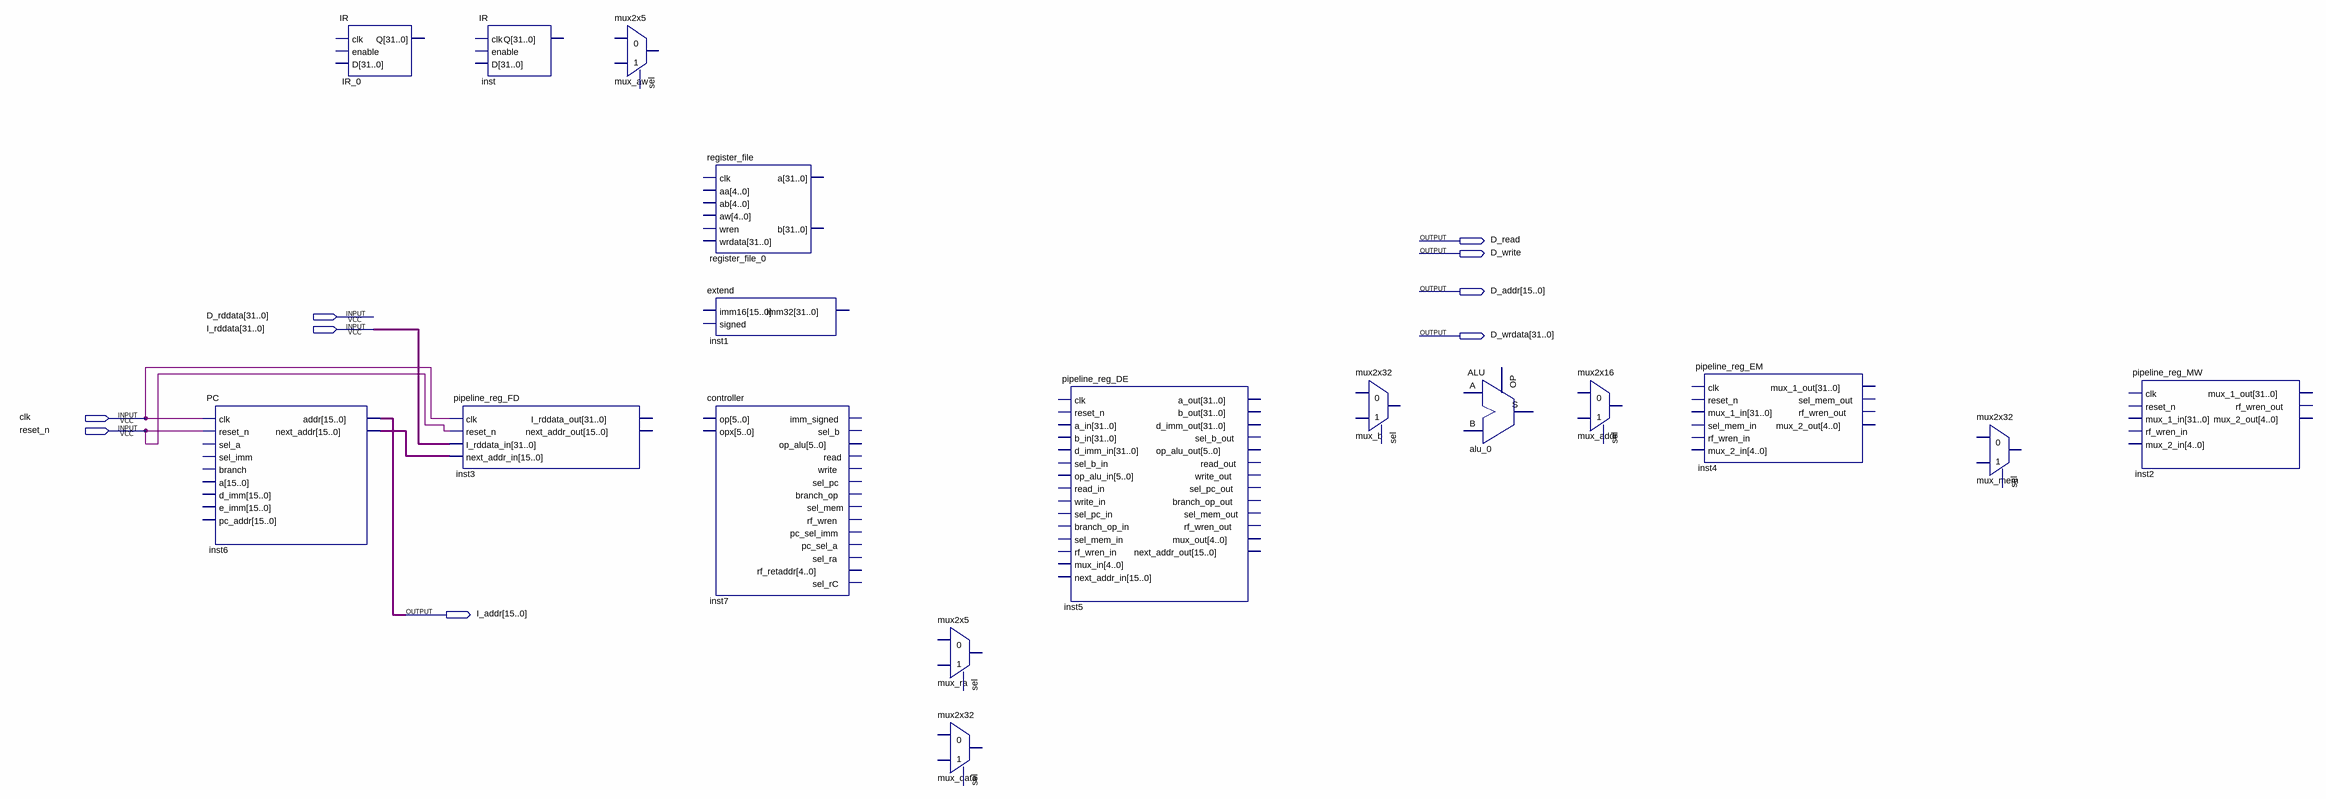
[diagram p0: schematic sheet]
// Quartus schematic CPU1.bdf as structural Verilog: 17 symbols, 9 pins
module CPU1 (
  input  [31:0] D_rddata,
  input  [31:0] I_rddata,
  input  clk,
  input  reset_n,
  output D_read,
  output D_write,
  output [15:0] D_addr,
  output [31:0] D_wrdata,
  output [15:0] I_addr
);

  wire [15:0] inst6_next_addr;

  PC inst6 (
    .clk(clk), .reset_n(reset_n), .addr(I_addr), .next_addr(inst6_next_addr));  // open: sel_a, sel_imm, branch, a, d_imm, e_imm, pc_addr
  IR IR_0 ();  // open: clk, enable, D, Q
  IR inst ();  // open: clk, enable, D, Q
  pipeline_reg_FD inst3 (
    .clk(clk), .reset_n(reset_n), .I_rddata_in(I_rddata), .next_addr_in(inst6_next_addr));  // open: I_rddata_out, next_addr_out
  mux2x5 mux_aw ();  // open: i0, i1, sel, o
  register_file register_file_0 ();  // open: clk, aa, ab, aw, wren, wrdata, a, b
  extend inst1 ();  // open: imm16, signed, imm32
  controller inst7 ();  // open: op, opx, imm_signed, sel_b, op_alu, read, write, sel_pc, branch_op, sel_mem, rf_wren, pc_sel_imm, pc_sel_a, sel_ra, rf_retaddr, sel_rC
  mux2x5 mux_ra ();  // open: i0, i1, sel, o
  mux2x32 mux_data ();  // open: i0, i1, sel, o
  pipeline_reg_DE inst5 ();  // open: clk, reset_n, a_in, b_in, d_imm_in, sel_b_in, op_alu_in, read_in, write_in, sel_pc_in, branch_op_in, sel_mem_in, rf_wren_in, mux_in, next_addr_in, a_out, b_out, d_imm_out, sel_b_out, op_alu_out, read_out, write_out, sel_pc_out, branch_op_out, sel_mem_out, rf_wren_out, mux_out, next_addr_out
  mux2x32 mux_b ();  // open: i0, i1, sel, o
  ALU alu_0 ();  // open: a, b, op, s
  mux2x16 mux_addr ();  // open: i0, i1, sel, o
  pipeline_reg_EM inst4 ();  // open: clk, reset_n, mux_1_in, sel_mem_in, rf_wren_in, mux_2_in, mux_1_out, sel_mem_out, rf_wren_out, mux_2_out
  mux2x32 mux_mem ();  // open: i0, i1, sel, o
  pipeline_reg_MW inst2 ();  // open: clk, reset_n, mux_1_in, rf_wren_in, mux_2_in, mux_1_out, rf_wren_out, mux_2_out
endmodule
